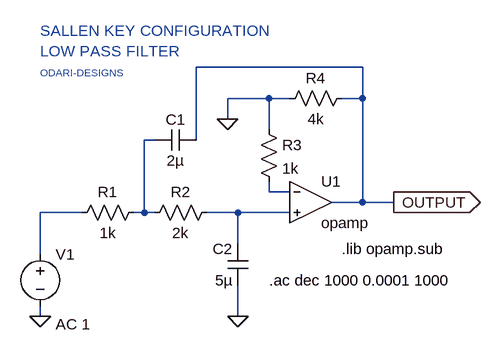
[diagram p0: schematic Ltspice_simulation.asc]
Ltspice_simulation.asc, the LTspice schematic file:
Version 4.1
SHEET 1 880 680
WIRE 304 -64 48 -64
WIRE 160 -16 96 -16
WIRE 192 -16 160 -16
WIRE 304 -16 304 -64
WIRE 304 -16 272 -16
WIRE 96 16 96 -16
WIRE 160 32 160 -16
WIRE -16 48 -32 48
WIRE 48 48 48 -64
WIRE 160 128 160 112
WIRE 192 128 160 128
WIRE 304 144 304 -16
WIRE 304 144 256 144
WIRE 352 144 304 144
WIRE -128 160 -192 160
WIRE -32 160 -32 48
WIRE -32 160 -48 160
WIRE -16 160 -32 160
WIRE 112 160 64 160
WIRE 192 160 112 160
WIRE 112 208 112 160
WIRE -192 224 -192 160
WIRE -192 320 -192 304
WIRE 112 320 112 272
FLAG 112 320 0
FLAG 352 144 OUTPUT
IOPIN 352 144 Out
FLAG -192 320 0
FLAG 96 16 0
SYMBOL OpAmps\\opamp 224 80 R0
SYMATTR InstName U1
SYMBOL cap 48 32 R90
WINDOW 0 0 32 VBottom 2
WINDOW 3 32 32 VTop 2
SYMATTR InstName C1
SYMATTR Value 2µ
SYMBOL cap 128 272 R180
WINDOW 0 24 56 Left 2
WINDOW 3 24 8 Left 2
SYMATTR InstName C2
SYMATTR Value 5µ
SYMBOL res -32 144 R90
WINDOW 0 0 56 VBottom 2
WINDOW 3 32 56 VTop 2
SYMATTR InstName R1
SYMATTR Value 1k
SYMBOL res 80 144 R90
WINDOW 0 0 56 VBottom 2
WINDOW 3 32 56 VTop 2
SYMATTR InstName R2
SYMATTR Value 2k
SYMBOL voltage -192 208 R0
WINDOW 123 24 124 Left 2
WINDOW 39 0 0 Left 0
SYMATTR InstName V1
SYMATTR Value ""
SYMATTR Value2 AC 1
SYMBOL res 144 16 R0
SYMATTR InstName R3
SYMATTR Value 1k
SYMBOL res 288 -32 R90
WINDOW 0 0 56 VBottom 2
WINDOW 3 32 56 VTop 2
SYMATTR InstName R4
SYMATTR Value 4k
TEXT 272 216 Left 2 !.lib opamp.sub
TEXT 160 264 Left 2 !.ac dec 1000 0.0001 1000
TEXT -192 -120 Left 2 ;SALLEN KEY CONFIGURATION\nLOW PASS FILTER
TEXT -192 -56 Left 1 ;ODARI-DESIGNS

The netlist it stands for:
* Ltspice_simulation.asc
X§U1 N002 N004 OUTPUT opamp Aol=100K GBW=10Meg  ; pins invin noninvin out
C1 OUTPUT N001 2µ
C2 0 N004 5µ
R1 N001 N003 1k
R2 N004 N001 2k
V1 N003 0 AC 1
R3 0 N002 1k
R4 OUTPUT 0 4k
.lib opamp.sub
.ac dec 1000 0.0001 1000
* SALLEN KEY CONFIGURATION
* LOW PASS FILTER
* ODARI-DESIGNS
.backanno
.end